# Altium schematic sheet ch634x.SchDoc
size A3; SheetNumber: 1; SheetTotal: 1
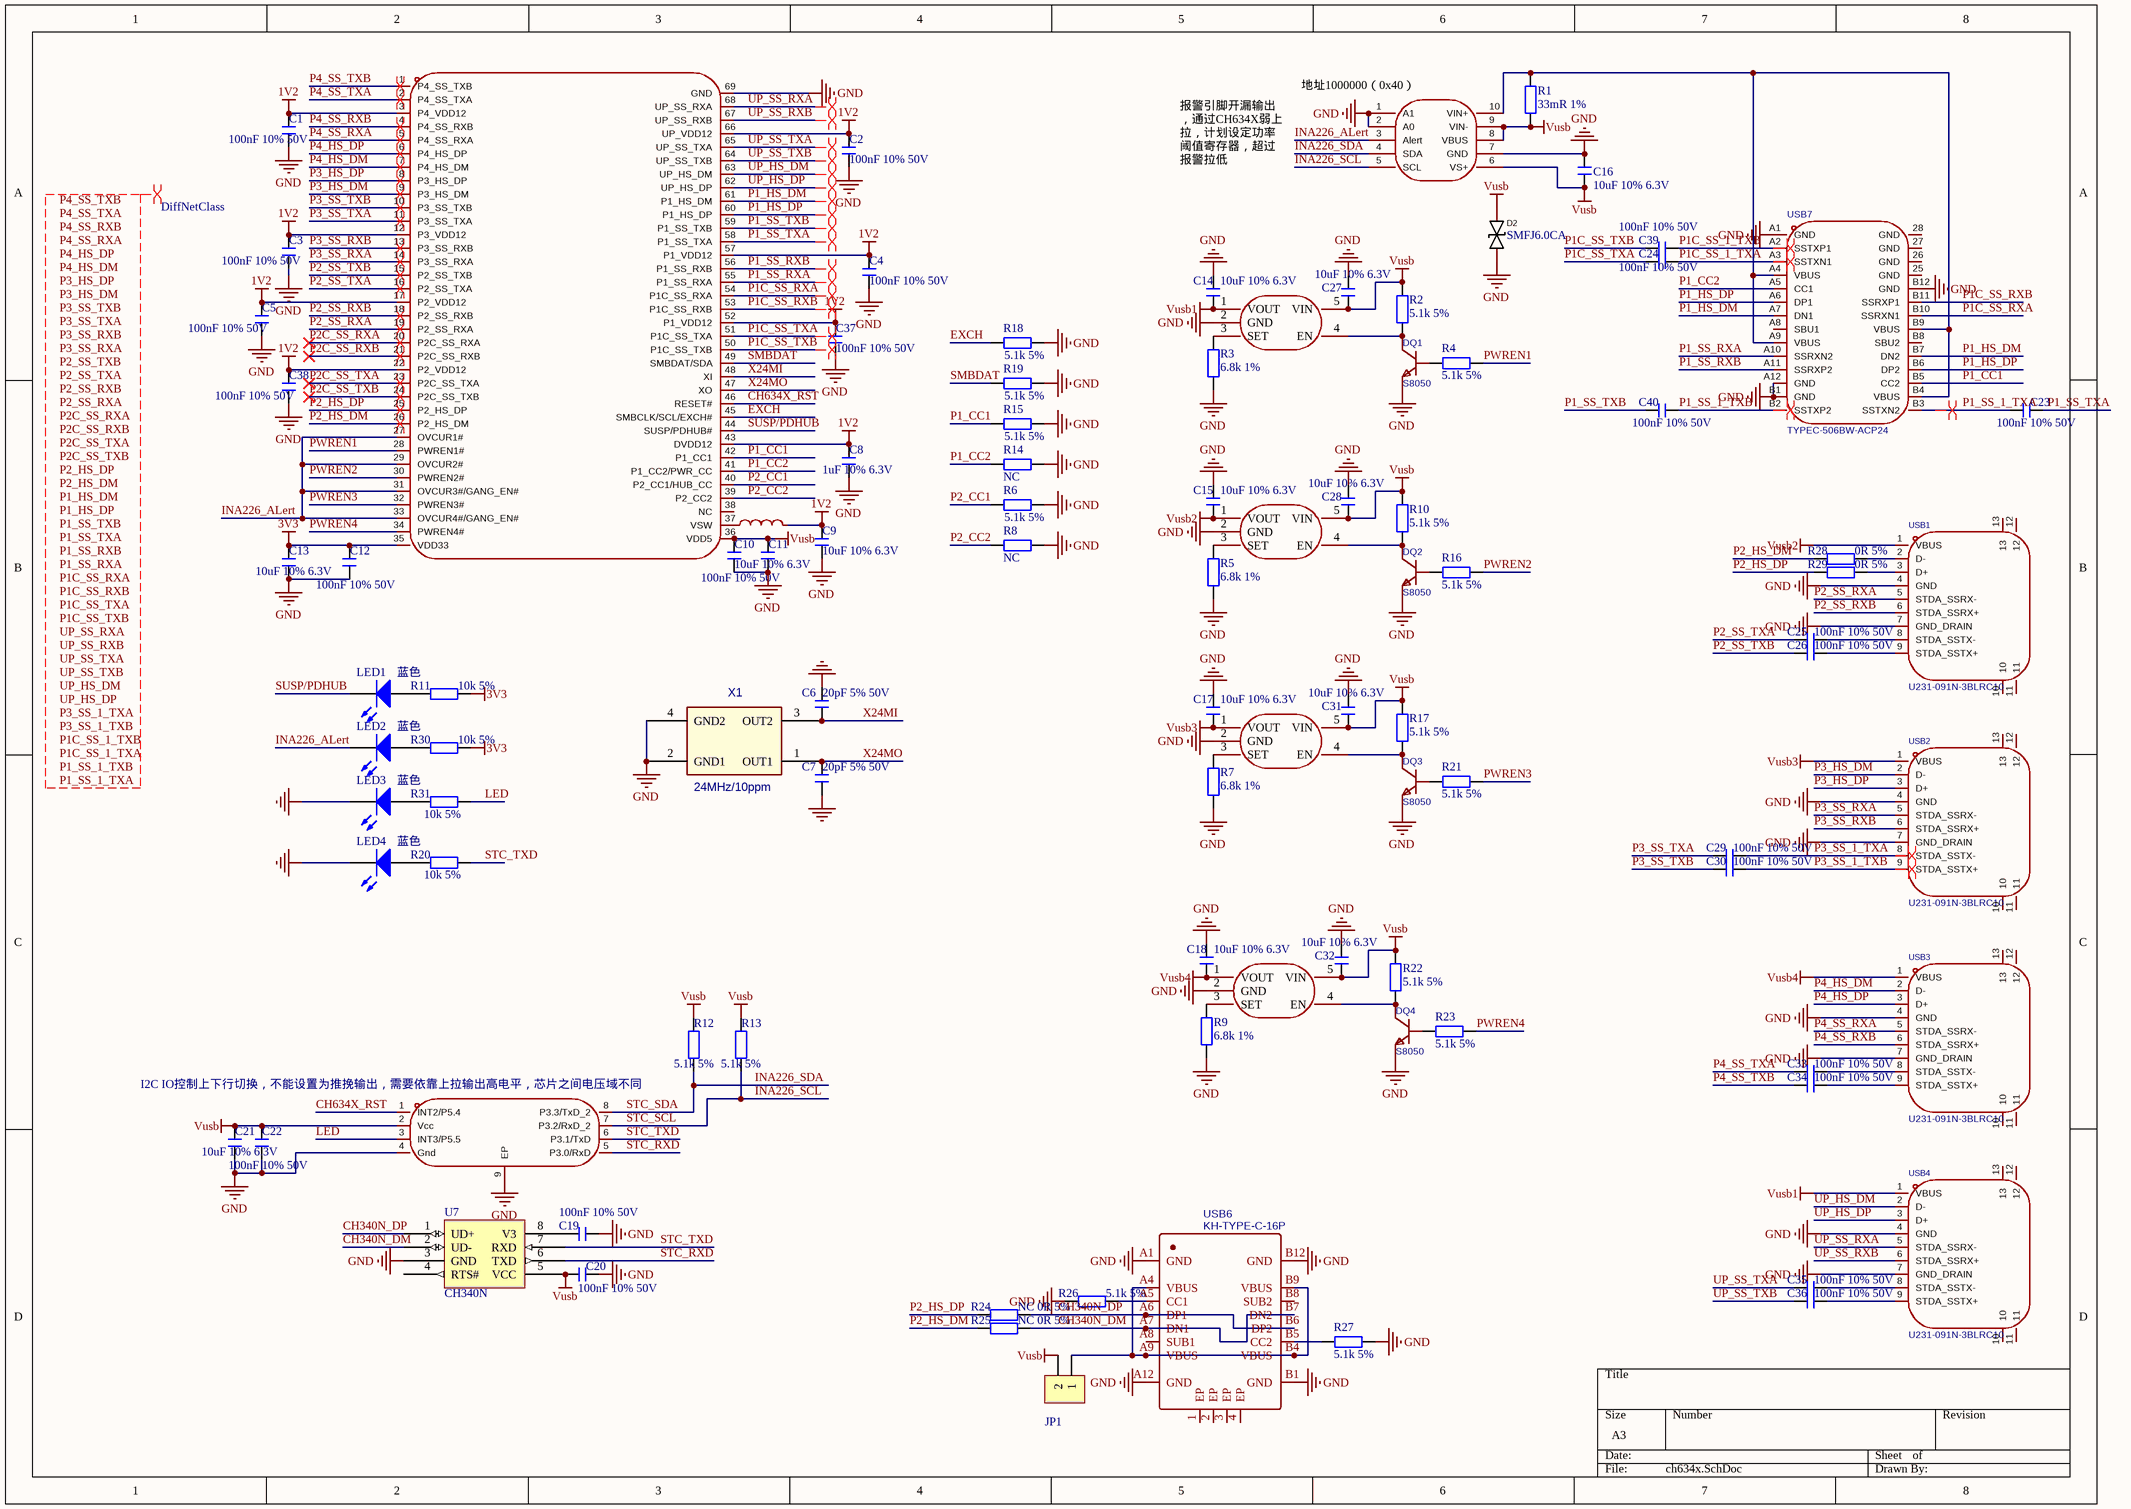
[diagram p0: ch634x.SchDoc]

## Parts
C1  100nF 10% 50V  [C0603_L]
C2  100nF 10% 50V  [C0603_L]
C3  100nF 10% 50V  [C0603_L]
C4  100nF 10% 50V  [C0603_L]
C5  100nF 10% 50V  [C0603_L]
C6  20pF 5% 50V  [C0603_L]
C7  20pF 5% 50V  [C0603_L]
C8  1uF 10% 6.3V  [C0603_L]
C9  10uF 10% 6.3V  [C0603_L]
C10  100nF 10% 50V  [C0603_L]
C11  10uF 10% 6.3V  [C0603_L]
C12  100nF 10% 50V  [C0603_L]
C13  10uF 10% 6.3V  [C0603_L]
C14  10uF 10% 6.3V  [C0603_L]
C15  10uF 10% 6.3V  [C0603_L]
C16  10uF 10% 6.3V  [C0603_L]
C17  10uF 10% 6.3V  [C0603_L]
C18  10uF 10% 6.3V  [C0603_L]
C19  100nF 10% 50V  [C0603_L]
C20  100nF 10% 50V  [C0603_L]
C21  10uF 10% 6.3V  [C0603_L]
C22  100nF 10% 50V  [C0603_L]
C23  100nF 10% 50V  [R0402_L]
C24  100nF 10% 50V  [R0402_L]
C25  100nF 10% 50V  [C0402_L]
C26  100nF 10% 50V  [C0402_L]
C27  10uF 10% 6.3V  [C0603_L]
C28  10uF 10% 6.3V  [C0603_L]
C29  100nF 10% 50V  [C0402_L]
C30  100nF 10% 50V  [C0402_L]
C31  10uF 10% 6.3V  [C0603_L]
C32  10uF 10% 6.3V  [C0603_L]
C33  100nF 10% 50V  [C0402_L]
C34  100nF 10% 50V  [C0402_L]
C35  100nF 10% 50V  [C0402_L]
C36  100nF 10% 50V  [C0402_L]
C37  100nF 10% 50V  [C0603_L]
C38  100nF 10% 50V  [C0603_L]
C39  100nF 10% 50V  [R0402_L]
C40  100nF 10% 50V  [R0402_L]
D2  SMFJ6.0CA  [SOD-123F_L2.8-W1.8-LS3.7-RD]
DQ1  S8050  [SOT-23-3_L2.9-W1.6-P1.90-LS2.8-BR]
DQ2  S8050  [SOT-23-3_L2.9-W1.6-P1.90-LS2.8-BR]
DQ3  S8050  [SOT-23-3_L2.9-W1.6-P1.90-LS2.8-BR]
DQ4  S8050  [SOT-23-3_L2.9-W1.6-P1.90-LS2.8-BR]
JP1  HDR-1X2  [HDR2.54-LI-2P]  (value not drawn)
L1  ftc252012s100mbca  [IND-SMD_L2.5-W2.0]  (value not drawn)
LED1  蓝色  [LED0603-FD]
LED2  蓝色  [LED0603-FD]
LED3  蓝色  [LED0603-FD]
LED4  蓝色  [LED0603-FD]
R1  33mR 1%  [R1206_L]
R2  5.1k 5%  [R0603_L]
R3  6.8k 1%  [R0603_L]
R4  5.1k 5%  [R0603_L]
R5  6.8k 1%  [R0603_L]
R6  5.1k 5%  [R0603_L]
R7  6.8k 1%  [R0603_L]
R8  NC  [R0603_L]
R9  6.8k 1%  [R0603_L]
R10  5.1k 5%  [R0603_L]
R11  10k 5%  [R0603_L]
R12  5.1k 5%  [R0603_L]
R13  5.1k 5%  [R0603_L]
R14  NC  [R0603_L]
R15  5.1k 5%  [R0603_L]
R16  5.1k 5%  [R0603_L]
R17  5.1k 5%  [R0603_L]
R18  5.1k 5%  [R0603_L]
R19  5.1k 5%  [R0603_L]
R20  10k 5%  [R0603_L]
R21  5.1k 5%  [R0603_L]
R22  5.1k 5%  [R0603_L]
R23  5.1k 5%  [R0603_L]
R24  NC 0R 5%  [R0603_L]
R25  NC 0R 5%  [R0603_L]
R26  5.1k 5%  [R0603_L]
R27  5.1k 5%  [R0603_L]
R28  0R 5%  [R0603_L]
R29  0R 5%  [R0603_L]
R30  10k 5%  [R0603_L]
R31  10k 5%  [R0603_L]
U1  ch634x_c48985831  [QFN-68_L8.0-W8.0-P0.40-BL-EP6.2]  (value not drawn)
U2  MT9700  [SOT-23-5_L3.0-W1.7-P0.95-LS2.8-BR]  (value not drawn)
U3  MT9700  [SOT-23-5_L3.0-W1.7-P0.95-LS2.8-BR]  (value not drawn)
U4  ina226aidgsr  [MSOP-10_L3.0-W3.0-P0.50-LS5.0-BL]  (value not drawn)
U5  MT9700  [SOT-23-5_L3.0-W1.7-P0.95-LS2.8-BR]  (value not drawn)
U6  MT9700  [SOT-23-5_L3.0-W1.7-P0.95-LS2.8-BR]  (value not drawn)
U7  CH340N  [SOP8]
U8  stc8g1k08-36i-dfn8  [DFN-8_L3.0-W3.0-P0.50-BL-EP]  (value not drawn)
USB1  U231-091N-3BLRC10  [USB-A-TH_U231-091N-5]
USB2  U231-091N-3BLRC10  [USB-A-TH_U231-091N-5]
USB3  U231-091N-3BLRC10  [USB-A-TH_U231-091N-5]
USB4  U231-091N-3BLRC10  [USB-A-TH_U231-091N-5]
USB6  KH-TYPE-C-16P  [KH-TYPE-C]
USB7  TYPEC-506BW-ACP24  [USB-C-SMD_TYPEC-506BW-ACP24]
X1  24MHz/10ppm  [OSC-3225-4P]

## Nets
1V2: C1.1 C2.1 C3.1 C4.1 C5.1 C8.1 C9.1 C37.1 C38.1 L1.1 U1.3(P4_VDD12) U1.12(P3_VDD12) U1.17(P2_VDD12) U1.22(P2_VDD12) U1.43(DVDD12) U1.52(P1_VDD12) U1.57(P1_VDD12) U1.66(UP_VDD12)
3V3: C12.1 C13.2 R11.1 R30.1 U1.35(VDD33)
GND: C1.2 C2.2 C3.2 C4.2 C5.2 C6.1 C7.1 C8.2 C9.2 C10.2 C11.1 C12.2 C13.1 C14.2 C15.2 C16.1 C17.2 C18.2 C19.2 C20.1 C21.1 C22.2 C27.2 C28.2 C31.2 C32.2 C37.2 C38.2 D2.1 DQ1.2 DQ2.2 DQ3.2 DQ4.2 LED3.2(K) LED4.2(K) R3.1 R5.1 R6.2 R7.1 R8.2 R9.1 R14.2 R15.2 R18.2 R19.2 R26.1 R27.1 U1.69(GND) U2.2(GND) U3.2(GND) U4.1(A1) U4.2(A0) U4.7(GND) U5.2(GND) U6.2(GND) U7.3(GND) U8.4(Gnd) U8.9(EP) USB1.4(GND) USB1.7(GND_DRAIN) USB2.4(GND) USB2.7(GND_DRAIN) USB3.4(GND) USB3.7(GND_DRAIN) USB4.4(GND) USB4.7(GND_DRAIN) USB6.A1(GND) USB6.A12(GND) USB6.B1(GND) USB6.B12(GND) USB7.A1(GND) USB7.A12(GND) USB7.B1(GND) USB7.B12(GND) X1.2(GND1) X1.4(GND2)
Vusb: C10.1 C11.2 C16.2 C20.2 C21.2 C22.1 C27.1 C28.1 C31.1 C32.1 D2.2 JP1.2 R1.1 R2.2 R10.2 R12.1 R13.1 R17.2 R22.2 U1.36(VDD5) U2.5(VIN) U3.5(VIN) U4.6(VS+) U4.8(VBUS) U4.9(VIN-) U5.5(VIN) U6.5(VIN) U7.5(VCC) U8.2(Vcc)
Vusb1: C14.1 U2.1(VOUT) USB4.1(VBUS)
Vusb2: C15.1 U3.1(VOUT) USB1.1(VBUS)
Vusb3: C17.1 U5.1(VOUT) USB2.1(VBUS)
Vusb4: C18.1 U6.1(VOUT) USB3.1(VBUS)
CH340N_DM: R25.2 U7.2(UD-) USB6.A7(DN1) USB6.B7(DN2)
CH340N_DP: R24.2 U7.1(UD+) USB6.A6(DP1) USB6.B6(DP2)
CH634X_RST: U1.46(RESET#) U8.1(INT2/P5.4)
EXCH: R18.1 U1.45(SMBCLK/SCL/EXCH#)
INA226_ALert: LED2.2(K) U1.27(OVCUR1#) U1.29(OVCUR2#) U1.31(OVCUR3#/GANG_EN#) U1.33(OVCUR4#/GANG_EN#) U4.3(Alert)
INA226_SCL: R13.2 U4.5(SCL) U8.7(P3.2/RxD_2)  [also labelled STC_SCL]
INA226_SDA: R12.2 U4.4(SDA) U8.8(P3.3/TxD_2)  [also labelled STC_SDA]
LED: R31.1 U8.3(INT3/P5.5)
P1_CC1: R15.1 U1.42(P1_CC1) USB7.B5(CC2)
P1_CC2: R14.1 U1.41(P1_CC2/PWR_CC) USB7.A5(CC1)
P1_HS_DM: U1.61(P1_HS_DM) USB7.A7(DN1) USB7.B7(DN2)
P1_HS_DP: U1.60(P1_HS_DP) USB7.A6(DP1) USB7.B6(DP2)
P1_SS_1_TXA: C23.1 USB7.B3(SSTXN2)
P1_SS_1_TXB: C40.2 USB7.B2(SSTXP2)
P1_SS_RXA: U1.55(P1_SS_RXA) USB7.A10(SSRXN2)
P1_SS_RXB: U1.56(P1_SS_RXB) USB7.A11(SSRXP2)
P1_SS_TXA: C23.2 U1.58(P1_SS_TXA)
P1_SS_TXB: C40.1 U1.59(P1_SS_TXB)
P1C_SS_1_TXA: C24.2 USB7.A3(SSTXN1)
P1C_SS_1_TXB: C39.2 USB7.A2(SSTXP1)
P1C_SS_RXA: U1.54(P1C_SS_RXA) USB7.B10(SSRXN1)
P1C_SS_RXB: U1.53(P1C_SS_RXB) USB7.B11(SSRXP1)
P1C_SS_TXA: C24.1 U1.51(P1C_SS_TXA)
P1C_SS_TXB: C39.1 U1.50(P1C_SS_TXB)
P2_CC1: R6.1 U1.40(P2_CC1/HUB_CC)
P2_CC2: R8.1 U1.39(P2_CC2)
P2_HS_DM: R25.1 R28.1 U1.26(P2_HS_DM)
P2_HS_DP: R24.1 R29.1 U1.25(P2_HS_DP)
P2_SS_RXA: U1.19(P2_SS_RXA) USB1.5(STDA_SSRX-)
P2_SS_RXB: U1.18(P2_SS_RXB) USB1.6(STDA_SSRX+)
P2_SS_TXA: C25.1 U1.16(P2_SS_TXA)
P2_SS_TXB: C26.1 U1.15(P2_SS_TXB)
P2C_SS_RXA: U1.20(P2C_SS_RXA)
P2C_SS_RXB: U1.21(P2C_SS_RXB)
P2C_SS_TXA: U1.23(P2C_SS_TXA)
P2C_SS_TXB: U1.24(P2C_SS_TXB)
P3_HS_DM: U1.9(P3_HS_DM) USB2.2(D-)
P3_HS_DP: U1.8(P3_HS_DP) USB2.3(D+)
P3_SS_1_TXA: C29.2 USB2.8(STDA_SSTX-)
P3_SS_1_TXB: C30.2 USB2.9(STDA_SSTX+)
P3_SS_RXA: U1.14(P3_SS_RXA) USB2.5(STDA_SSRX-)
P3_SS_RXB: U1.13(P3_SS_RXB) USB2.6(STDA_SSRX+)
P3_SS_TXA: C29.1 U1.11(P3_SS_TXA)
P3_SS_TXB: C30.1 U1.10(P3_SS_TXB)
P4_HS_DM: U1.7(P4_HS_DM) USB3.2(D-)
P4_HS_DP: U1.6(P4_HS_DP) USB3.3(D+)
P4_SS_RXA: U1.5(P4_SS_RXA) USB3.5(STDA_SSRX-)
P4_SS_RXB: U1.4(P4_SS_RXB) USB3.6(STDA_SSRX+)
P4_SS_TXA: C33.1 U1.2(P4_SS_TXA)
P4_SS_TXB: C34.1 U1.1(P4_SS_TXB)
PWREN1: R4.2 U1.28(PWREN1#)
PWREN2: R16.2 U1.30(PWREN2#)
PWREN3: R21.2 U1.32(PWREN3#)
PWREN4: R23.2 U1.34(PWREN4#)
SMBDAT: R19.1 U1.49(SMBDAT/SDA)
STC_RXD: U7.6(TXD) U8.5(P3.0/RxD)
STC_TXD: R20.1 U7.7(RXD) U8.6(P3.1/TxD)
SUSP/PDHUB: LED1.2(K) U1.44(SUSP/PDHUB#)
UP_HS_DM: U1.63(UP_HS_DM) USB4.2(D-)
UP_HS_DP: U1.62(UP_HS_DP) USB4.3(D+)
UP_SS_RXA: U1.68(UP_SS_RXA) USB4.5(STDA_SSRX-)
UP_SS_RXB: U1.67(UP_SS_RXB) USB4.6(STDA_SSRX+)
UP_SS_TXA: C35.1 U1.65(UP_SS_TXA)
UP_SS_TXB: C36.1 U1.64(UP_SS_TXB)
X24MI: C6.2 U1.48(XI) X1.3(OUT2)
X24MO: C7.2 U1.47(XO) X1.1(OUT1)
NetC19_1: C19.1 U7.8(V3)
NetC25_2: C25.2 USB1.8(STDA_SSTX-)
NetC26_2: C26.2 USB1.9(STDA_SSTX+)
NetC33_2: C33.2 USB3.8(STDA_SSTX-)
NetC34_2: C34.2 USB3.9(STDA_SSTX+)
NetC35_2: C35.2 USB4.8(STDA_SSTX-)
NetC36_2: C36.2 USB4.9(STDA_SSTX+)
NetDQ1_1: DQ1.1 R4.1
NetDQ1_3: DQ1.3 R2.1 U2.4(EN)
NetDQ2_1: DQ2.1 R16.1
NetDQ2_3: DQ2.3 R10.1 U3.4(EN)
NetDQ3_1: DQ3.1 R21.1
NetDQ3_3: DQ3.3 R17.1 U5.4(EN)
NetDQ4_1: DQ4.1 R23.1
NetDQ4_3: DQ4.3 R22.1 U6.4(EN)
NetJP1_1: JP1.1 USB6.A4(VBUS) USB6.A9(VBUS) USB6.B4(VBUS) USB6.B9(VBUS)
NetL1_2: L1.2 U1.37(VSW)
NetLED1_1: LED1.1(A) R11.2
NetLED2_1: LED2.1(A) R30.2
NetLED3_1: LED3.1(A) R31.2
NetLED4_1: LED4.1(A) R20.2
NetR1_2: R1.2 U4.10(VIN+) USB7.A4(VBUS) USB7.A9(VBUS) USB7.B4(VBUS) USB7.B9(VBUS)
NetR3_2: R3.2 U2.3(SET)
NetR5_2: R5.2 U3.3(SET)
NetR7_2: R7.2 U5.3(SET)
NetR9_2: R9.2 U6.3(SET)
NetR26_2: R26.2 USB6.A5(CC1)
NetR27_2: R27.2 USB6.B5(CC2)
NetR28_2: R28.2 USB1.2(D-)
NetR29_2: R29.2 USB1.3(D+)

Not connected (* = marked no-connect by the designer): U1 38(NC); U7 4(RTS#); USB1 10 11 12 13; USB2 10 11 12 13; USB3 10 11 12 13; USB4 10 11 12 13; USB6 1(EP) 2(EP) 3(EP) 4(EP) A8(SUB1) B8(SUB2); USB7 25(GND) 26(GND) 27(GND) 28(GND) A8(SBU1) B8(SBU2)

## Layout directives
differential pair: P1_HS_DM, P1_HS_DP, P1_SS_1_TXA, P1_SS_1_TXB, P1_SS_RXA, P1_SS_RXB, P1_SS_TXA, P1_SS_TXB, P1C_SS_1_TXA, P1C_SS_1_TXB, P1C_SS_RXA, P1C_SS_RXB, P1C_SS_TXA, P1C_SS_TXB, P2_HS_DM, P2_HS_DP, P2_SS_RXA, P2_SS_RXB, P2_SS_TXA, P2_SS_TXB, P2C_SS_RXA, P2C_SS_RXB, P2C_SS_TXA, P2C_SS_TXB, P3_HS_DM, P3_HS_DP, P3_SS_1_TXA, P3_SS_1_TXB, P3_SS_RXA, P3_SS_RXB, P3_SS_TXA, P3_SS_TXB, P4_HS_DM, P4_HS_DP, P4_SS_RXA, P4_SS_RXB, P4_SS_TXA, P4_SS_TXB, UP_HS_DM, UP_HS_DP, UP_SS_RXA, UP_SS_RXB, UP_SS_TXA, UP_SS_TXB
net class DiffNetClass: P1_HS_DM, P1_HS_DP, P1_SS_1_TXA, P1_SS_1_TXB, P1_SS_RXA, P1_SS_RXB, P1_SS_TXA, P1_SS_TXB, P1C_SS_1_TXA, P1C_SS_1_TXB, P1C_SS_RXA, P1C_SS_RXB, P1C_SS_TXA, P1C_SS_TXB, P2_HS_DM, P2_HS_DP, P2_SS_RXA, P2_SS_RXB, P2_SS_TXA, P2_SS_TXB, P2C_SS_RXA, P2C_SS_RXB, P2C_SS_TXA, P2C_SS_TXB, P3_HS_DM, P3_HS_DP, P3_SS_1_TXA, P3_SS_1_TXB, P3_SS_RXA, P3_SS_RXB, P3_SS_TXA, P3_SS_TXB, P4_HS_DM, P4_HS_DP, P4_SS_RXA, P4_SS_RXB, P4_SS_TXA, P4_SS_TXB, UP_HS_DM, UP_HS_DP, UP_SS_RXA, UP_SS_RXB, UP_SS_TXA, UP_SS_TXB

## Notes on the sheet
- (near U4) 地址1000000（0x40）
- 报警引脚开漏输出，通过CH634X弱上拉，计划设定功率阈值寄存器，超过报警拉低
- (near U8) I2C IO控制上下行切换，不能设置为推挽输出，需要依靠上拉输出高电平，芯片之间电压域不同
- Labels drawn without touching a wire or pin: P1_HS_DM, P1_HS_DP, P1_SS_1_TXA, P1_SS_1_TXB, P1_SS_RXA, P1_SS_RXB, P1_SS_TXA, P1_SS_TXB, P1C_SS_1_TXA, P1C_SS_1_TXB, P1C_SS_RXA, P1C_SS_RXB, P1C_SS_TXA, P1C_SS_TXB, P2_HS_DM, P2_HS_DP, P2_SS_RXA, P2_SS_RXB, P2_SS_TXA, P2_SS_TXB, P2C_SS_RXA, P2C_SS_RXB, P2C_SS_TXA, P2C_SS_TXB, P3_HS_DM, P3_HS_DP, P3_SS_1_TXA, P3_SS_1_TXB, P3_SS_RXA, P3_SS_RXB, P3_SS_TXA, P3_SS_TXB, P4_HS_DM, P4_HS_DP, P4_SS_RXA, P4_SS_RXB, P4_SS_TXA, P4_SS_TXB, UP_HS_DM, UP_HS_DP, UP_SS_RXA, UP_SS_RXB, UP_SS_TXA, UP_SS_TXB

## Library data of the parts
C1-C40 = C: 贴片电容; BOM名称: 无极性贴片电容; 优秀评价可免费更新: 联系淘宝ID：黄晶宝石，获取更新版封装库; 卖家免费技术支持，联系售后: 唯一出售店铺网址https://shop463601444.taobao.com; 本封装库来自淘宝卖家 ID：黄晶宝石: 其他店铺购入均为盗版，请立即申请退款
D2 = SMFJ6.5CA: 瞬态抑制二极管; Manufacturer: BORN伯恩半导体; Add into BOM: yes; Polarity: 双向; Reverse Stand-Off Voltage (Vrwm): 6.5V; Breakdown Voltage (Min): 7.22V; Breakdown Voltage (Max): 7.98V; Reverse Leakage Current (Ir): 250μA; Peak Pulse Current (Ipp)@10/1000μs: 17.9A; Maximum Clamping Voltage: 11.2V; Peak Pulse Power Dissipation (Ppp)@10/1000μs: 200W; Symbol: SMFJ6.5CA; Device: SMFJ6.5CA; LCSC Part Name: 双向 6.5V 200W; Supplier Part: C2842363; Manufacturer Part: SMFJ6.5CA; Supplier Footprint: SOD-123FL; JLCPCB Part Class: Extended Part; Datasheet: https://atta.szlcsc.com/upload/public/pdf/source/20181211/C152064_2CFB5B95395FB4F205D55C4FF132895F.pdf; Supplier: LCSC; Convert to PCB: yes
DQ1-DQ4 = S8050: 贴片三极管; BOM_Manufacturer: Hottech; Contributor: LCSC; BOM_Supplier: LCSC; BOM_Manufacturer Part: S8050; BOM_Supplier Part: C181158; BOM_JLCPCB Part Class: Extended Part; spicePre: Q; spiceSymbolName: S8050_C181158
JP1 = Header 2: 2P接插件; 联系卖家，免费查找封装: 唯一出售店铺网址https://shop463601444.taobao.com; 封装库来自淘宝卖家ID：黄晶宝石: 其他店铺购入均为盗版封装库，请立即申请退款，本店现金奖励50~200元; BOM名称: 2P接插件
L1 = ftc252012s100mbca: 电感值:10uH;精度:±20%;额定电流:1.2A;饱和电流(Isat):1.6A;类型:一体成型电感;; Manufacturer: cjiang(长江微电); AddInBom: yes; ModelId: 85d117b4abb34d9087271edcd9ba0330; ModelName: IND-SMD_L2.5-W2.0-H1.2; ModelTransform: 99.2124,78.74,0,0,0,0,0,0,0; Value: 10uH; Tolerance: ±20%; Rated Current: 1.2A; Saturation Current (Isat): 1.6A; DC Resistance (DCR): 330mΩ; Type: 一体成型电感; Symbol: FTC252012S100MBCA; LCSC Part Name: 10uH ±20% 1.6A; SupplierPart: C5832376; ManufacturerPart: FTC252012S100MBCA; Supplier Footprint: SMD,2x2.5mm; JLCPCB Part Class: Extended Part; Datasheet: https://atta.szlcsc.com/upload/public/pdf/source/20230602/8FFEDA9C0247A92A0D4B67554BFE4091.pdf; Supplier: LCSC; ConvertToPcb: yes; FootprintName: IND-SMD_L2.5-W2.0
LED1-LED4 = LED: 贴片LED; 封装库来自淘宝卖家：黄晶宝石: 其他店铺购入均为盗版封装库，无更新权益，请立即申请退款，本店现金奖励200~1000元; BOM名称: 贴片LED
R1 = R: FRM121WFR033TM; BOM名称: 贴片电阻; 优秀评价可免费更新: 联系淘宝ID：黄晶宝石，获取更新版封装库; 卖家免费技术支持，联系售后: 唯一出售店铺网址https://shop463601444.taobao.com; 本封装库来自淘宝卖家 ID：黄晶宝石: 其他店铺购入均为盗版，请立即申请退款
R2-R31 = R: 贴片电阻; 优秀评价可免费更新: 联系淘宝ID：黄晶宝石，获取更新版封装库; 卖家免费技术支持，联系售后: 唯一出售店铺网址https://shop463601444.taobao.com; 本封装库来自淘宝卖家 ID：黄晶宝石: 其他店铺购入均为盗版，请立即申请退款; BOM名称: 贴片电阻
U1 = ch634x_c48985831: 符合USB3.2 Gen1协议规范的4端口USB超高速HUB控制器芯片,CH634X内置两组Type-C双通道USB3.0 PHY和双PD PHY，原生支持Type-C正反插自适应，原生支持PDHUB、Type-C15W和PD100W快充。; Manufacturer: WCH(南京沁恒); ManufacturerPart: CH634X; AddInBom: yes; ModelId: 72236333b5b14e54ba405b685275d4d4; ModelName: QFN-68_L8.0-W8.0-H0.8-P0.40-BL-EP; ModelTransform: 314.96,314.96,0,90,0,0,0,0,0; USB Protocol: USB 3.2; Data Rate: 5Gbps; Voltage - Supply: 3.3V；1.23V; Number of Channels: 4; Symbol: CH634X_C48985831; LCSC Part Name: 4端口USB3.0 HUB控制器芯片; SupplierPart: C48985831; Supplier Footprint: QFN-68(8x8); JLCPCB Part Class: Extended Part; Datasheet: https://item.szlcsc.com/datasheet/CH634X/51318833.html; Supplier: LCSC; ConvertToPcb: yes; FootprintName: QFN-68_L8.0-W8.0-P0.40-BL-EP6.2; Operating Temperature: -40℃~+85℃
U2 U3 U5 U6 = MT9700: Manufacturer: 西安航天民芯; Add into BOM: yes; Symbol: mt9700; Device: MT9700; LCSC Part Name: MT9700; Supplier Part: C89855; Manufacturer Part: MT9700; Supplier Footprint: SOT-23-5; JLCPCB Part Class: Extended Part; Datasheet: https://atta.szlcsc.com/upload/public/pdf/source/20170418/1492481333031.pdf; Supplier: LCSC; Convert to PCB: yes
U4 = ina226aidgsr: 放大器数:-;共模电压:0V~36V;增益:-;带宽(-3db):-;; Manufacturer: TI(德州仪器); AddInBom: yes; ModelId: b42a31f9e1fa4643bc7ea573b9bba7ed; ModelName: MSOP-10_L3.0-W3.0-H1.1-LS5.0-P0.50; ModelTransform: 118.11,196.85,0,0,0,0,0,0,0; Vcm - Common Mode Voltage: 0V~36V; Ib - Input Bias Current: 100pA; Vos - Input Offset Voltage: 2.5uV; Differential Voltage: ±40V; Single Supply: 2.7V~5.5V; Quiescent Current: 330uA; Input Offset Voltage Drift(Vos TC): 0.1uV/℃; Common Mode Rejection Ratio (CMRR): 140dB; Symbol: INA226AIDGSR; LCSC Part Name: 高侧/低侧测量双向电流/功率监视器，具有I²C兼容接口; SupplierPart: C49851; ManufacturerPart: INA226AIDGSR; Supplier Footprint: VSSOP-10; JLCPCB Part Class: Extended Part; Datasheet: https://www.ti.com/cn/lit/ds/symlink/ina226.pdf; Supplier: LCSC; ConvertToPcb: yes; FootprintName: MSOP-10_L3.0-W3.0-P0.50-LS5.0-BL; Number of Channels: -; Gain: -; Bandwidth: -; Operating Temperature: -40℃~+125℃; Dual Supply: -; Output Current: -; Gain Error: -; Slew Rate: -; Noise density(eN): -; Features: 可编程阈值告警；使能/关断功能；双向检测；数字输出接口；高边检测；低边检测；功率监控
U8 = stc8g1k08-36i-dfn8: CPU内核:51系列;应用领域:-;; Manufacturer: STC; AddInBom: yes; ModelId: 528cefc8c0de4e9cb29dce66c37be9e3; ModelName: DFN-8_L3.0-W3.0-H1.0-P0.50; ModelTransform: 118.8974,118.11,0,90,0,0,0,0,0; CPU Core: 51系列; Program Storage Size: 8KB; Program Memory Type: FLASH; Number of I/O: 6; Voltage - Supply: 1.9V~5.5V; Symbol: STC8G1K08-36I-DFN8; LCSC Part Name: 车规32位8051单片机; SupplierPart: C915662; ManufacturerPart: STC8G1K08-36I-DFN8; Supplier Footprint: DFN-8-EP(3x3); JLCPCB Part Class: Extended Part; Datasheet: https://item.szlcsc.com/datasheet/STC8G1K08-36I-DFN8/988330.html; Supplier: LCSC; ConvertToPcb: yes; FootprintName: DFN-8_L3.0-W3.0-P0.50-BL-EP; Applications: -
USB1-USB4 = U231-091N-3BLRC10: 连接器类型:Type-A;协议标准:-;公母:母;安装方式:弯插;触点数量:9P;端口数量:1;额定电流 - 电源:3A;工作温度:-40℃~+85℃;; Manufacturer: XKB Connection(中国星坤); Add into BOM: yes; 3D Model: bd1be6d9093e4954b9cfab3aa8294fa2; 3D Model Transform: 515.747,539.40837,0,0,0,0,0,-102.362,-47.244; Connector Type: Type-A; Gender: 母; Number of Contacts: 9P; Number of Ports: 1; Current Rating-Power: 3A; Voltage Rating: 100V; Symbol: U231-091N-3BLRC10; Device: U231-091N-3BLRC10; Convert to PCB: yes; Supplier: LCSC; Supplier Part: C2880627; Manufacturer Part: U231-091N-3BLRC10; JLCPCB Part Class: Extended Part; LCSC Part Name: Type-A 母 弯插; Supplier Footprint: 插件; Datasheet: https://item.szlcsc.com/datasheet/U231-091N-3BLRC10/3091119.html; Protocol Standard: -; Mounting Type: 弯插; Operating Temperature: -40℃~+85℃; Length: 13.7mm; FootprintName: USB-A-TH_U231-091N-5; ModelName: USB-A-TH_U231-091N-5
USB6 = KH-TYPE-C-16P: BOM_Manufacturer: Shenzhen Kinghelm Elec; Contributor: LCSC; BOM_Supplier: LCSC; BOM_Supplier Part: C709357; BOM_Manufacturer Part: KH-TYPE-C-16P; BOM_JLCPCB Part Class: Extended Part; spicePre: U; spiceSymbolName: KH-TYPE-C-16P
USB7 = TYPEC-506BW-ACP24: 连接器类型:Type-C;协议标准:USB 3.1;公母:母;安装方式:卧贴;触点数量:24P;端口数量:1;额定电流 - 电源:3A;工作温度:-25℃~+85℃;; Manufacturer: XUNPU(讯普); Add into BOM: yes; 3D Model: c748935c8fb4472fa81da41ad9c366f4; Connector Type: Type-C; Protocol Standard: USB 3.1; Gender: 母; Number of Contacts: 24P; Number of Ports: 1; Current Rating-Power: 3A; Connect-Disconnect Life: 1万次; Detection color: 黑色; 3D Model Transform: 455.011,482.283,0,0,0,0,0,-59.528,-62.992; Symbol: TYPEC-506BW-ACP24; Device: TYPEC-506BW-ACP24; Convert to PCB: yes; LCSC Part Name: Type-C 母 卧贴; Supplier Part: C2895019; Manufacturer Part: TYPEC-506BW-ACP24; Supplier Footprint: SMD; JLCPCB Part Class: Extended Part; Datasheet: https://item.szlcsc.com/datasheet/TYPEC-506BW-ACP24/3132956.html; Supplier: LCSC; Mounting Type: 卧贴; Voltage Rating: -; Length: 11.95mm; Operating Temperature: -25℃~+85℃; FootprintName: USB-C-SMD_TYPEC-506BW-ACP24; ModelName: USB-C-SMD_TYPEC-506BW-ACP24
X1 = OSC44M_5: 晶振